# Altium schematic sheet mcu.SchDoc
size A4
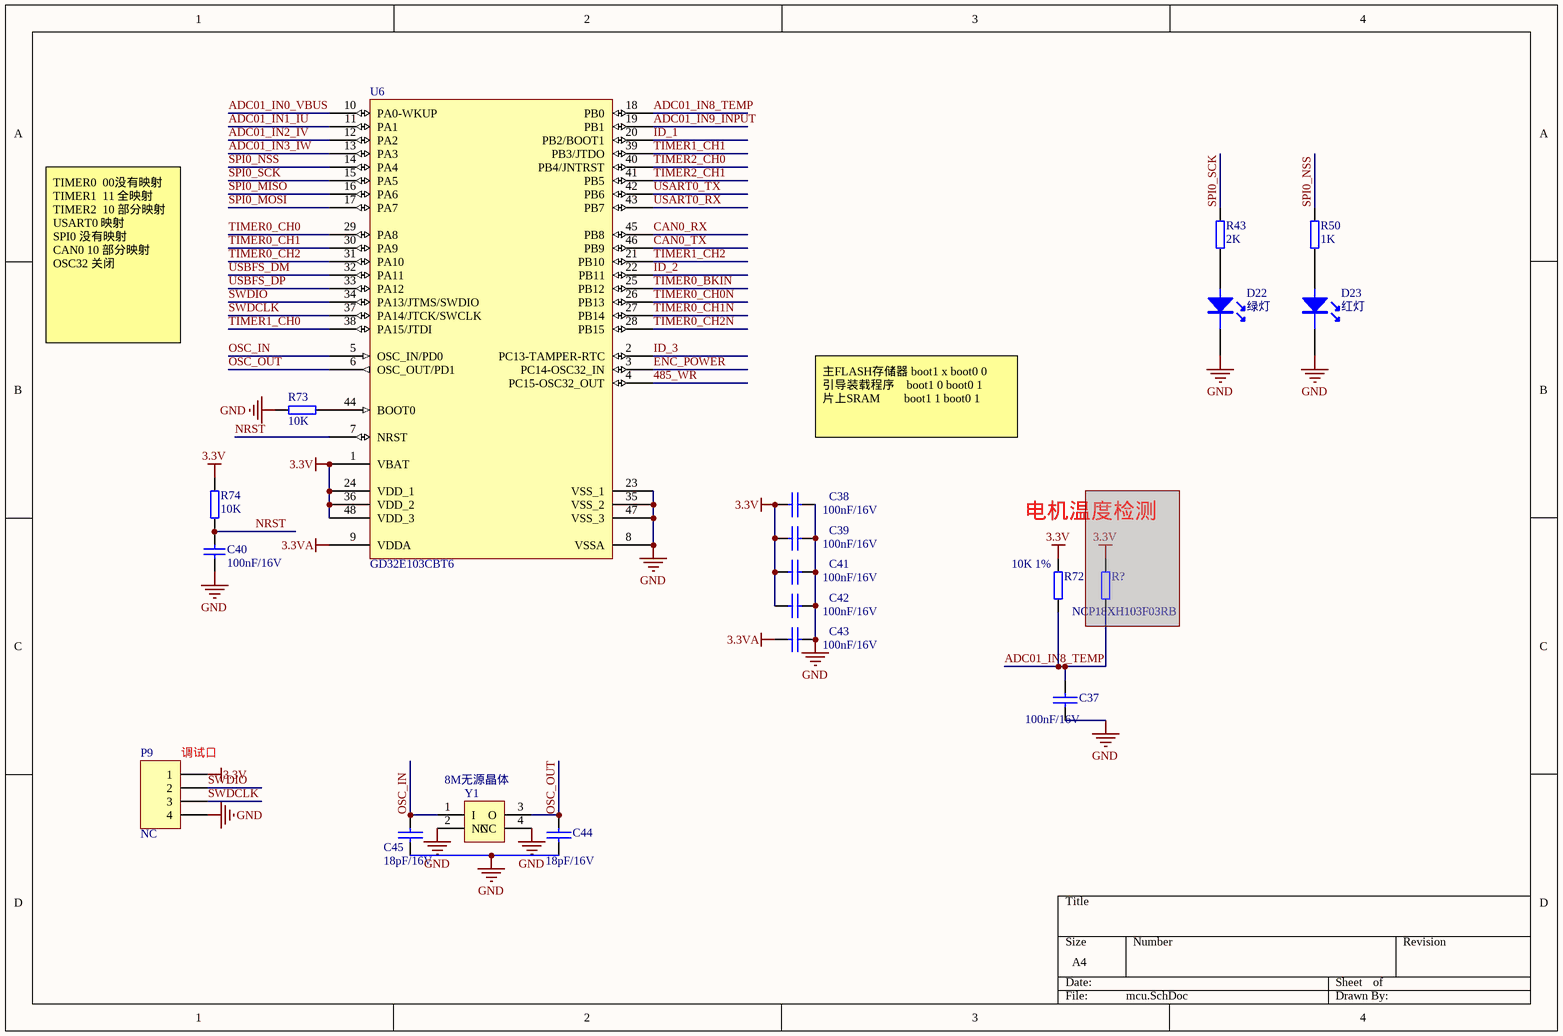
[diagram p0: mcu.SchDoc]

## Parts
C37  100nF/16V  [C0402]
C38  100nF/16V  [C0402]
C39  100nF/16V  [C0402]
C40  100nF/16V  [C0402]
C41  100nF/16V  [C0402]
C42  100nF/16V  [C0402]
C43  100nF/16V  [C0402]
C44  18pF/16V  [C0402]
C45  18pF/16V  [C0402]
D22  绿灯  [LED_0603]
D23  红灯  [LED_0603]
P9  NC  [2.0*4]
R43  2K  [R0402]
R50  1K  [R0402]
R72  10K 1%  [R0402]
R73  10K  [R0402]
R74  10K  [R0402]
R?  NCP18XH103F03RB  [R0603]  (masked out: inside a compile mask, not in the netlist)
U6  GD32E103CBT6  [LQFP-48]
Y1  8M无源晶体  [5032 4pin]

## Nets
3.3V: C38.2 C39.2 C41.2 C42.2 P9.1 R72.2 R74.2 U6.1(VBAT) U6.24(VDD_1) U6.36(VDD_2) U6.48(VDD_3)
3.3VA: C43.2 U6.9(VDDA)
GND: C37.2 C38.1 C39.1 C40.1 C41.1 C42.1 C43.1 C44.1 C45.1 D22.2(K) D23.2(K) P9.4 R73.1 U6.8(VSSA) U6.23(VSS_1) U6.35(VSS_2) U6.47(VSS_3) Y1.2(NC) Y1.4(NC)
485_WR: U6.4(PC15-OSC32_OUT)
ADC01_IN0_VBUS: U6.10(PA0-WKUP)
ADC01_IN1_IU: U6.11(PA1)
ADC01_IN2_IV: U6.12(PA2)
ADC01_IN3_IW: U6.13(PA3)
ADC01_IN8_TEMP: C37.1 R72.1 U6.18(PB0)
ADC01_IN9_INPUT: U6.19(PB1)
CAN0_RX: U6.45(PB8)
CAN0_TX: U6.46(PB9)
ENC_POWER: U6.3(PC14-OSC32_IN)
ID_1: U6.20(PB2/BOOT1)
ID_2: U6.22(PB11)
ID_3: U6.2(PC13-TAMPER-RTC)
NRST: C40.2 R74.1 U6.7(NRST)
OSC_IN: C45.2 U6.5(OSC_IN/PD0) Y1.1(I)
OSC_OUT: C44.2 U6.6(OSC_OUT/PD1) Y1.3(O)
SPI0_MISO: U6.16(PA6)
SPI0_MOSI: U6.17(PA7)
SPI0_NSS: R50.1 U6.14(PA4)
SPI0_SCK: R43.1 U6.15(PA5)
SWDCLK: P9.3 U6.37(PA14/JTCK/SWCLK)
SWDIO: P9.2 U6.34(PA13/JTMS/SWDIO)
TIMER0_BKIN: U6.25(PB12)
TIMER0_CH0: U6.29(PA8)
TIMER0_CH0N: U6.26(PB13)
TIMER0_CH1: U6.30(PA9)
TIMER0_CH1N: U6.27(PB14)
TIMER0_CH2: U6.31(PA10)
TIMER0_CH2N: U6.28(PB15)
TIMER1_CH0: U6.38(PA15/JTDI)
TIMER1_CH1: U6.39(PB3/JTDO)
TIMER1_CH2: U6.21(PB10)
TIMER2_CH0: U6.40(PB4/JNTRST)
TIMER2_CH1: U6.41(PB5)
USART0_RX: U6.43(PB7)
USART0_TX: U6.42(PB6)
USBFS_DM: U6.32(PA11)
USBFS_DP: U6.33(PA12)
NetD22_1: D22.1(A) R43.2
NetD23_1: D23.1(A) R50.2
NetR73_2: R73.2 U6.44(BOOT0)

## Notes on the sheet
- TIMER0  00没有映射
  TIMER1  11 全映射
  TIMER2  10 部分映射
  USART0 映射
  SPI0 没有映射
  CAN0 10 部分映射
  OSC32 关闭
- 主FLASH存储器 boot1 x boot0 0
  引导装载程序    boot1 0 boot0 1
  片上SRAM        boot1 1 boot0 1
- 电机温度检测
- (near P9) 调试口

## Library data of the parts
C37-C39 C41-C45 = CAP: Capacitor
C40 = cap
D22 = LED: 绿灯led
D23 = LED: 红灯led
P9 = 排针2mm,1*4: 空，无器件; LatestRevisionDate: 17-Jul-2002; LatestRevisionNote: Re-released for DXP Platform.; Publisher: Altium Limited
R43 R50 R72 = R
R73 R74 = Resistance
R? = R: 风华贴片NTC 120K 5%
U6 = GD32E103CxT6: Published: *; DatasheetVersion: *; PackageVersion: *; PackageReference: *; Publisher: *; PackageDescription: *; ComponentLink1Description: *; ComponentLink1URL: *; ComponentLink2Description: *; ComponentLink2URL: *
Y1 = OSC24